# EAGLE design Pyr0-Piezo-FFC-Direct-Creality-X_MIN.v2.1.2 (EAGLE 9.5.1)
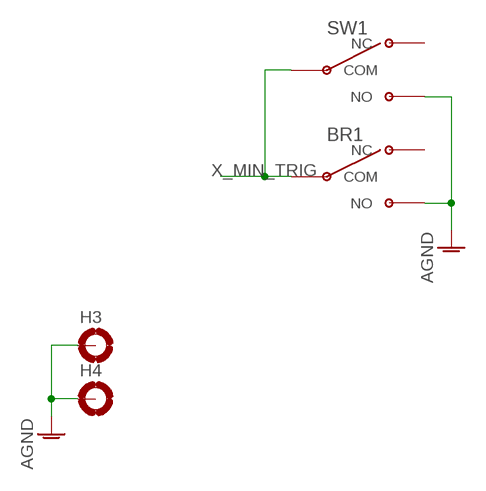
[diagram p0: schematic, sheet 1]

## Parts
BR1  LIMIT_SWITCH  [LIMIT_SWITCH_BRIDGE]
H3  HOLES_MOUNT-PAD-ROUND3.2  [HOLES_3,2-PAD]
H4  HOLES_MOUNT-PAD-ROUND3.2  [HOLES_3,2-PAD]
SW1  LIMIT_SWITCHMICRO_SPDT_5.08  [MICROSWITCH_5.08]

## Nets
AGND [VCC]: BR1.NO H3.B3,2(MOUNT) H4.B3,2(MOUNT) SW1.P$2(NO)
X_MIN_TRIG: BR1.COM SW1.P$1(COM)
Unconnected: BR1.NC SW1.P$3(NC)

## Library data of the parts
BR1 SW1 = PiezoFFC:LIMIT_SWITCH
H3 H4 = PiezoFFC:HOLES_MOUNT-PAD-ROUND: MOUNTING PAD, round

## Net classes
1 Motor: width 0.61 mm, drill 0.45 mm, clearance 0.254 mm to class 0, clearance 0.254 mm
2 Fan: width 0.305 mm, drill 0.35 mm, clearance 0.152 mm to class 0, clearance 0.254 mm to class 1, clearance 0.152 mm
3 VCC: width 1.27 mm, drill 0.5 mm, clearance 0.254 mm to class 0, clearance 0.254 mm to class 1, clearance 0.254 mm to class 2, clearance 0.254 mm

## Board
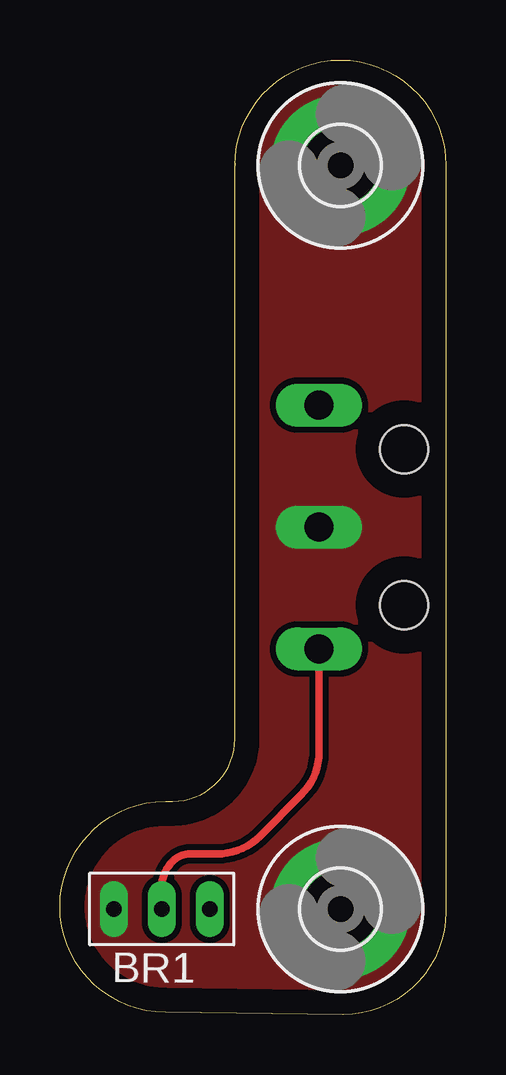
[diagram p1: board, top side]
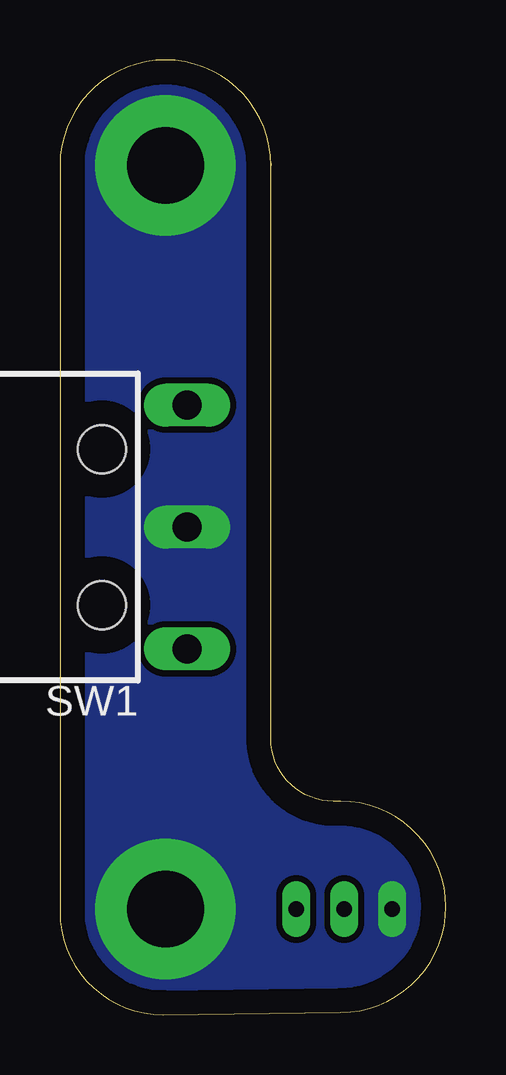
[diagram p2: board, bottom side, seen from below]

Size 16.1 x 39.8 mm. Coordinates in mm from the lower left corner, seen from the top.
Outline: 7.3,35.4 7.3,11.5 arc-90 4.7,8.9 4.4,8.9 arc90 0,4.5 arc90 4.4,0.1 11.8,0 arc90 16.1,4.3 16.1,35.4 arc90 11.7,39.8 arc90 7.3,35.4
Outline: 7.3,35.5 7.3,35.4
Copper layers (1*16): Top 0.035mm / dielectric 1.5mm / Bottom 0.035mm
Design rules "default *": minimum track width 6mil, minimum drill 0.35mm, track to track 6mil, track to pad 6mil, pad to pad 6mil, via to via 6mil, smd to smd 6mil, copper to edge 40mil, drill to drill 6mil, minimum pad ring 10mil, minimum via ring 8mil, stop-mask expansion 4mil, vias tented up to drill 0.5mm, thermal gap 10mil

### Footprints (pad centres in the part's own frame; a part is rotated, then mirrored left to right if it is on the bottom)
LIMIT_SWITCH_BRIDGE = drill 0.65 long: COM 0,0; NC -2,0; NO 2,0
HOLES_3,2-PAD = drill 3.2 pad 5.842: B3,2 0,0
MICROSWITCH_5.08 = drill 1.2 long: P$1 0,5.08; P$2 0,0; P$3 0,-5.08 | hole 2: 3.55,3.25; 3.55,-3.25

### Placement (x,y rotation side)
BR1  4.25,4.41 180 top
H3  11.7,4.4 0 top
H4  11.7,35.4 0 top
SW1  10.8,20.33 180 bottom

### Tracks (layer width: path | path; a pad name or v marks a point on that pad's centre or on a via)
AGND
  pour Top (no thermals): 4.4,8.9 arc90 0,4.5 arc90 4.4,0.1 11.8,0 arc90 16.1,4.3 16.1,35.4 arc90 11.7,39.8 arc90 7.3,35.4 7.3,11.5 arc-90 4.7,8.9
  pour Bottom (no thermals): 4.4,0.1 arc-90 0,4.5 arc-90 4.4,8.9 4.7,8.9 arc90 7.3,11.5 7.3,35.4 arc-90 11.7,39.8 arc-90 16.1,35.4 16.1,4.3 arc-90 11.8,0
X_MIN_TRIG
  Top 0.305: SW1.P$1 10.8,10.95 arc-45 10.06,9.16 8.34,7.44 arc-45 6.55,6.7 5.42,6.7 arc45 4.7,6.4 arc45 4.25,5.3 BR1.COM